# EAGLE board MCAT-CANYVAL-TOP-5X1 (EAGLE 7.2.0)
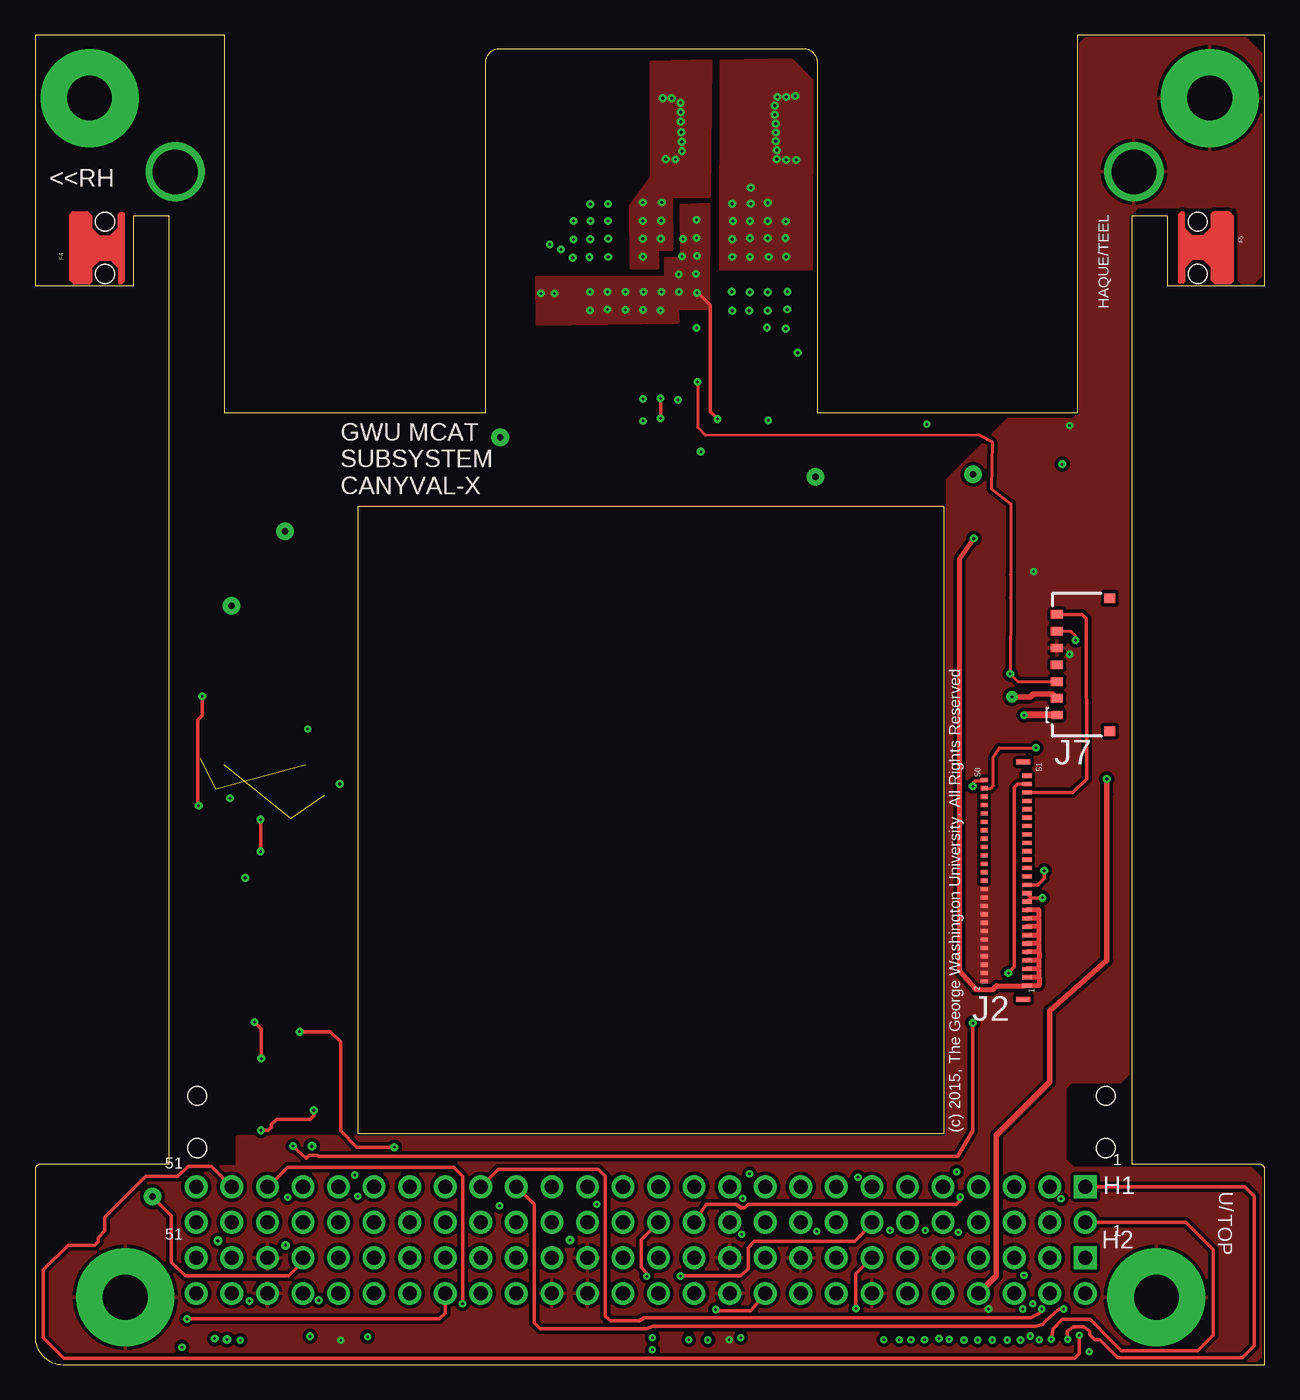
[diagram p4: board, top side]
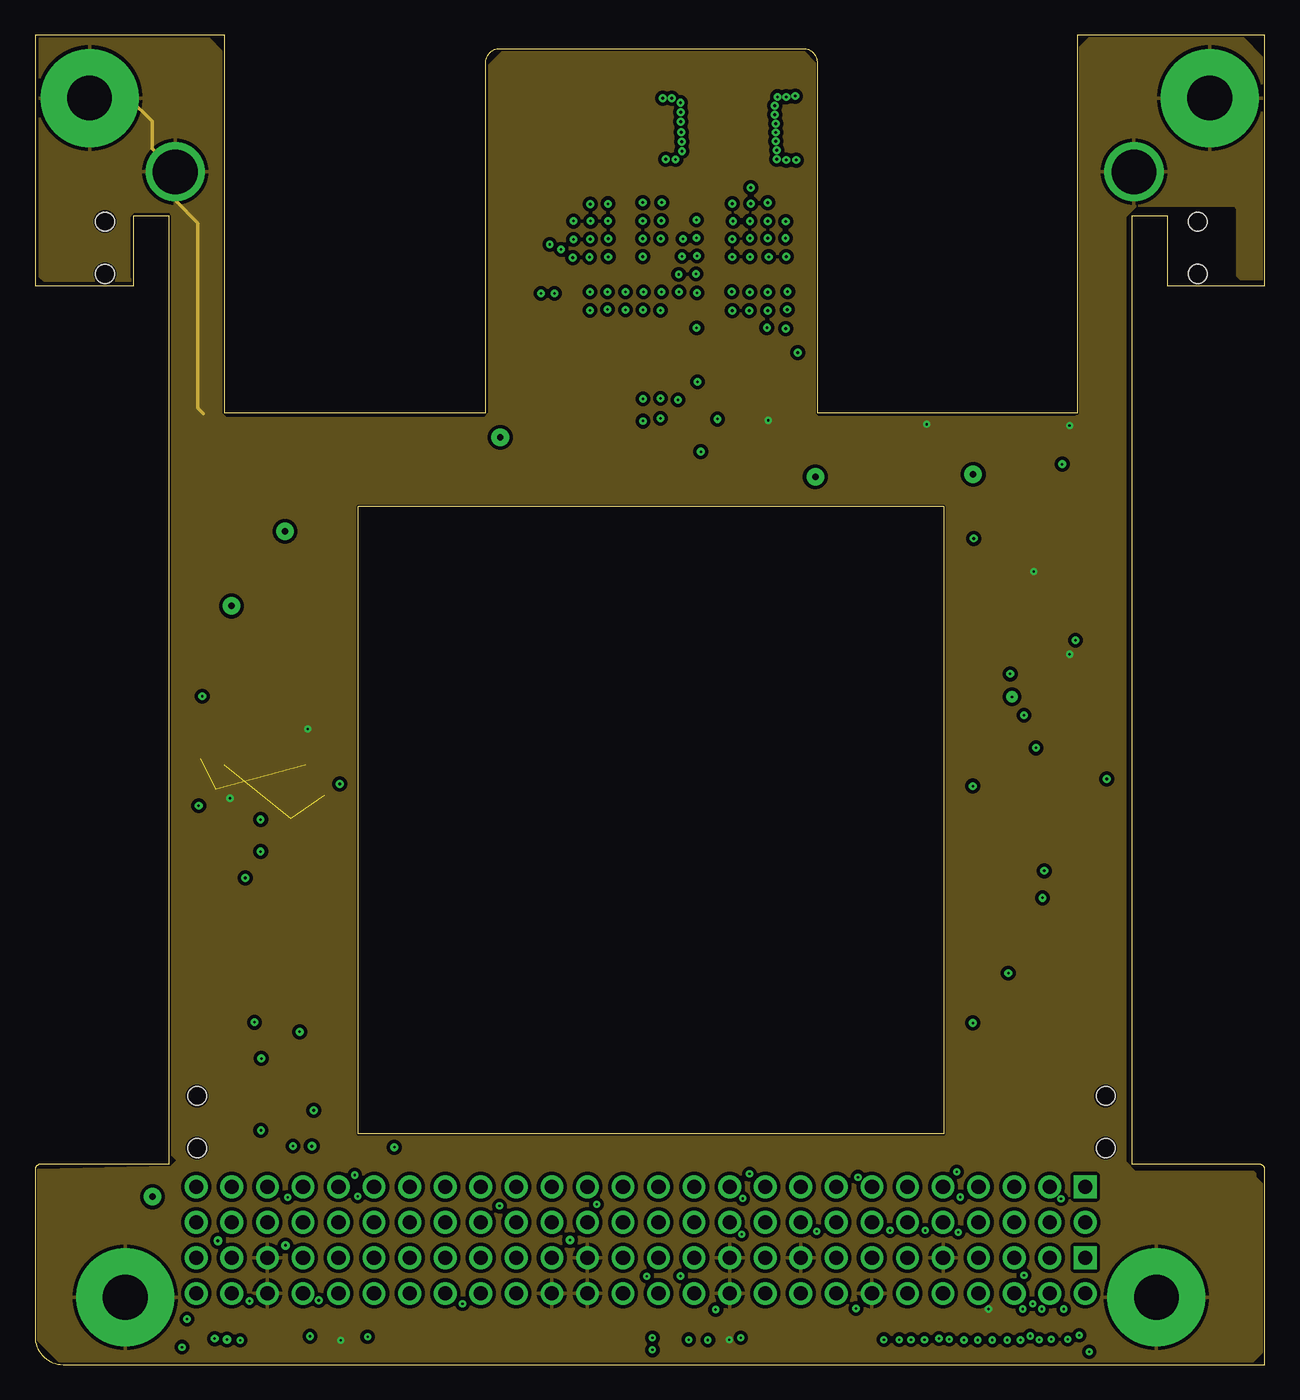
[diagram p5: board, inner layer L2/TopGround]
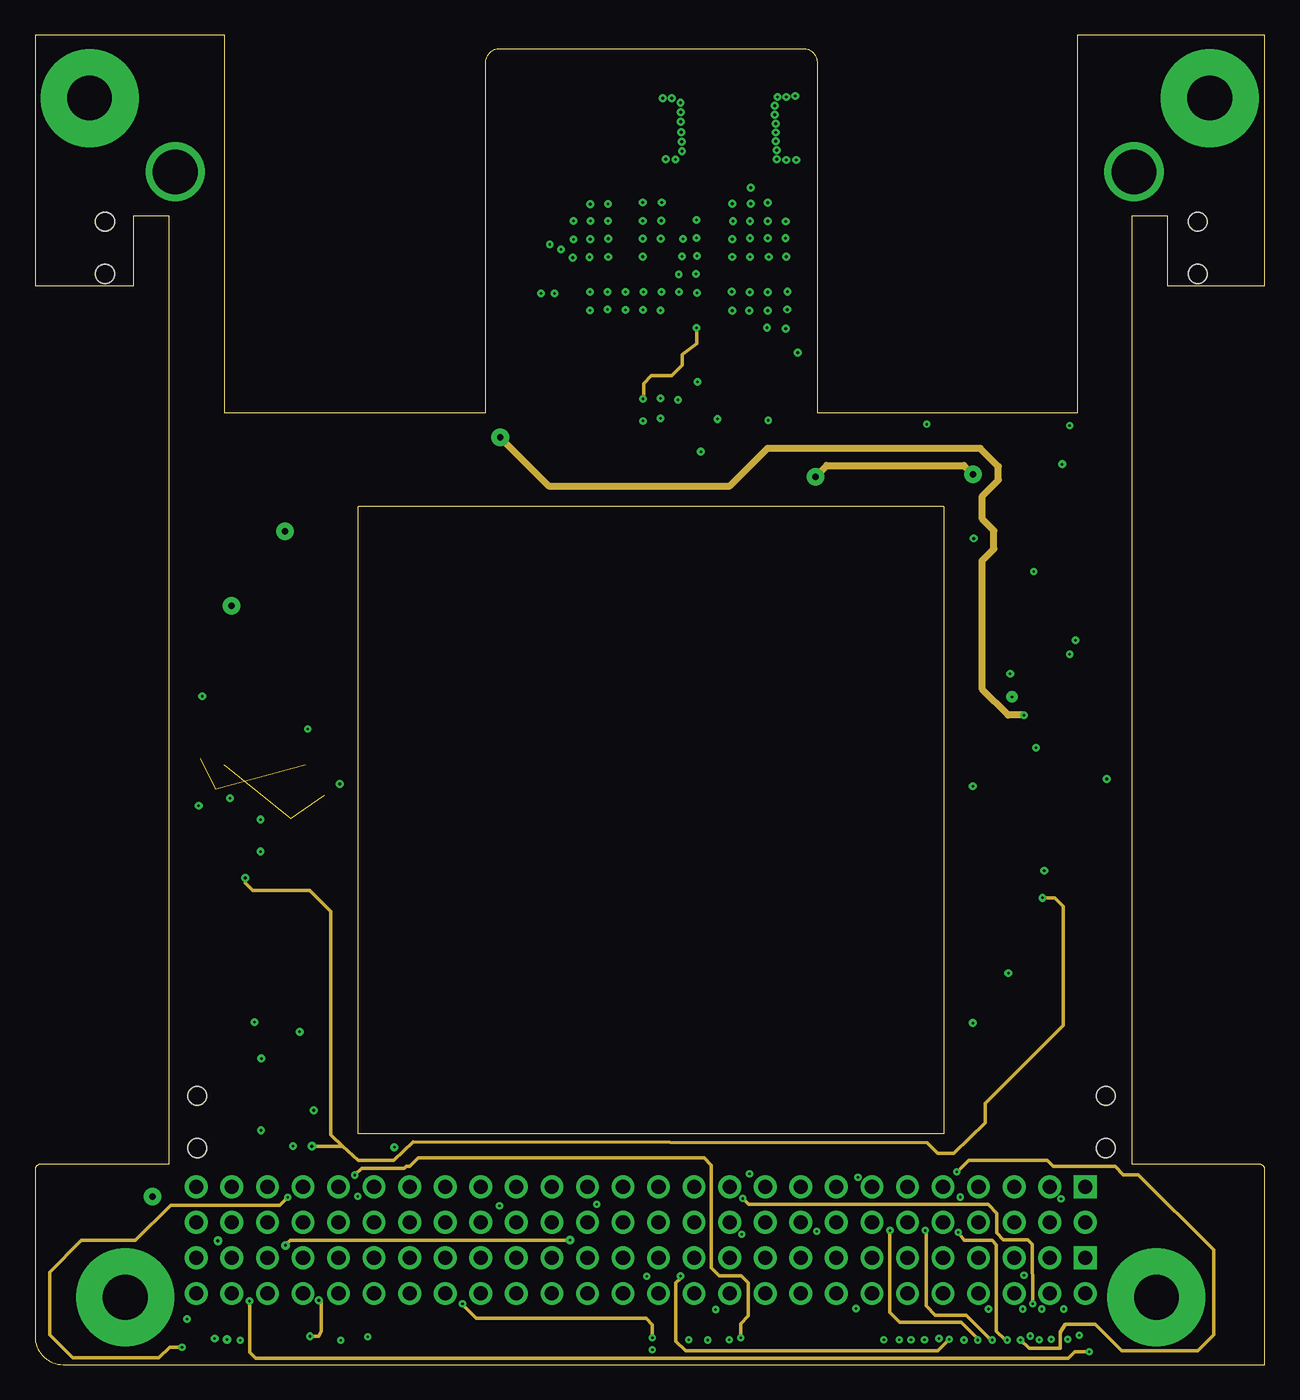
[diagram p6: board, inner layer L3/Power1]
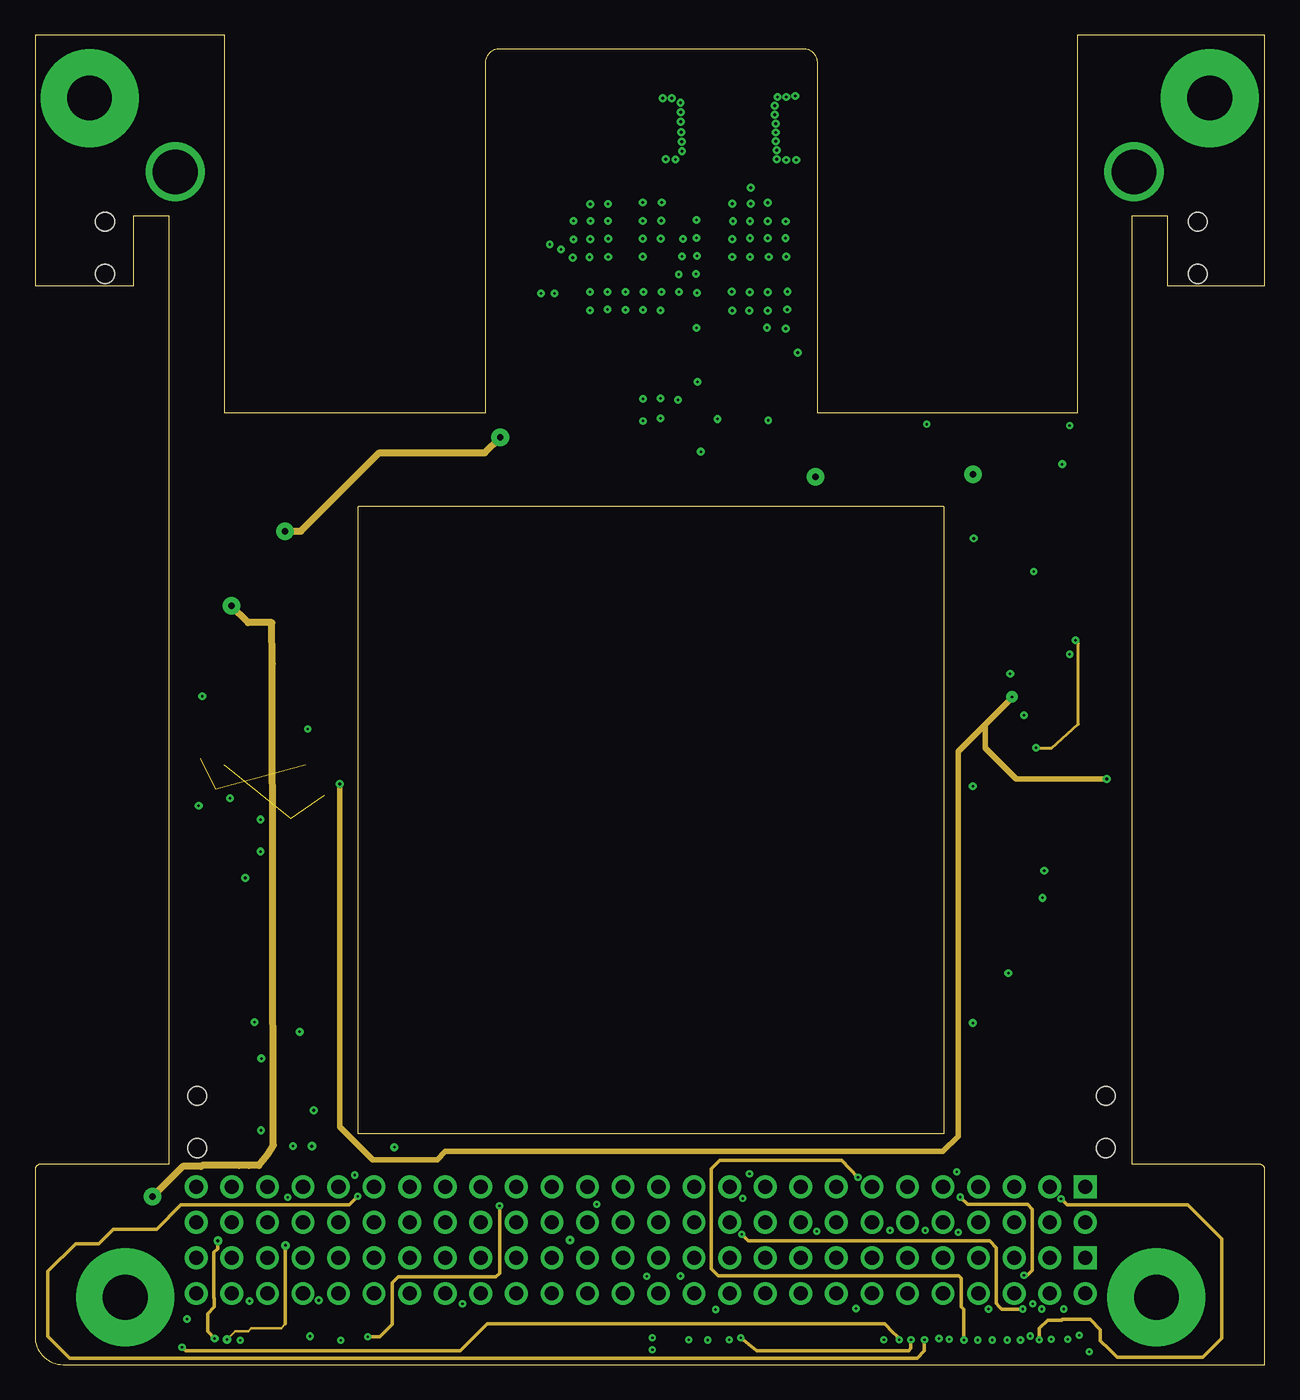
[diagram p7: board, inner layer L14/Power2]
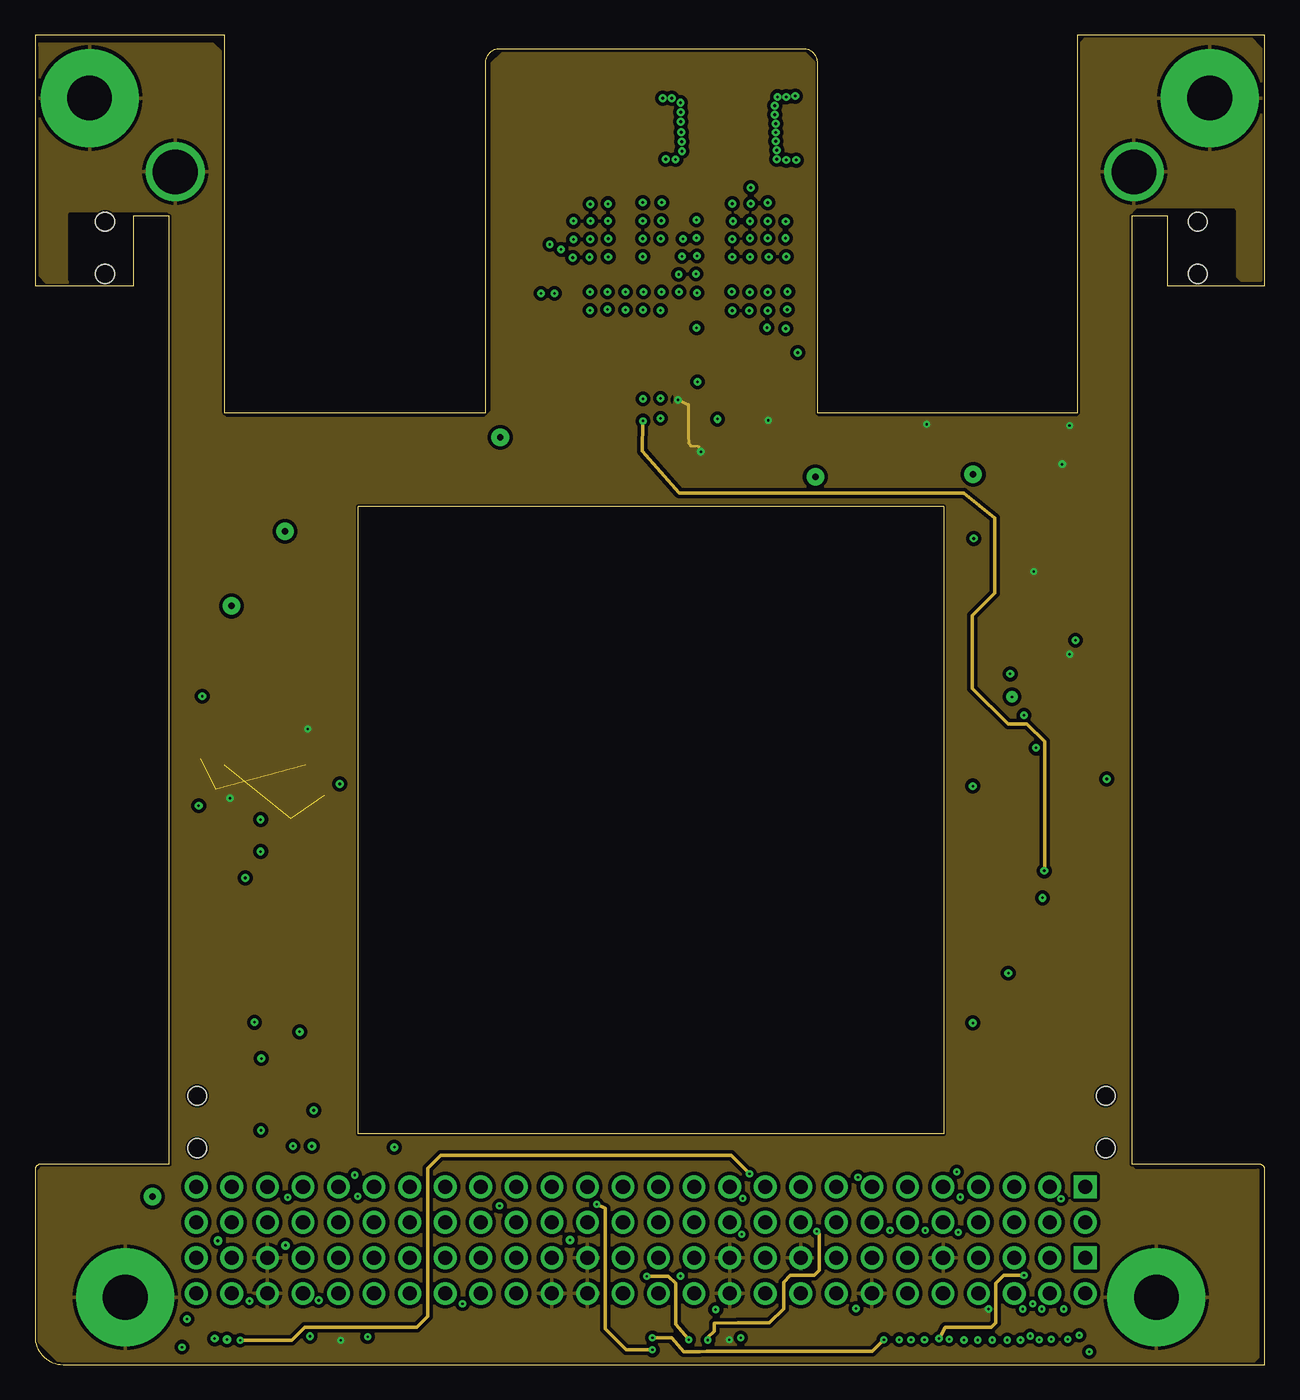
[diagram p8: board, inner layer L15/BottomGround]
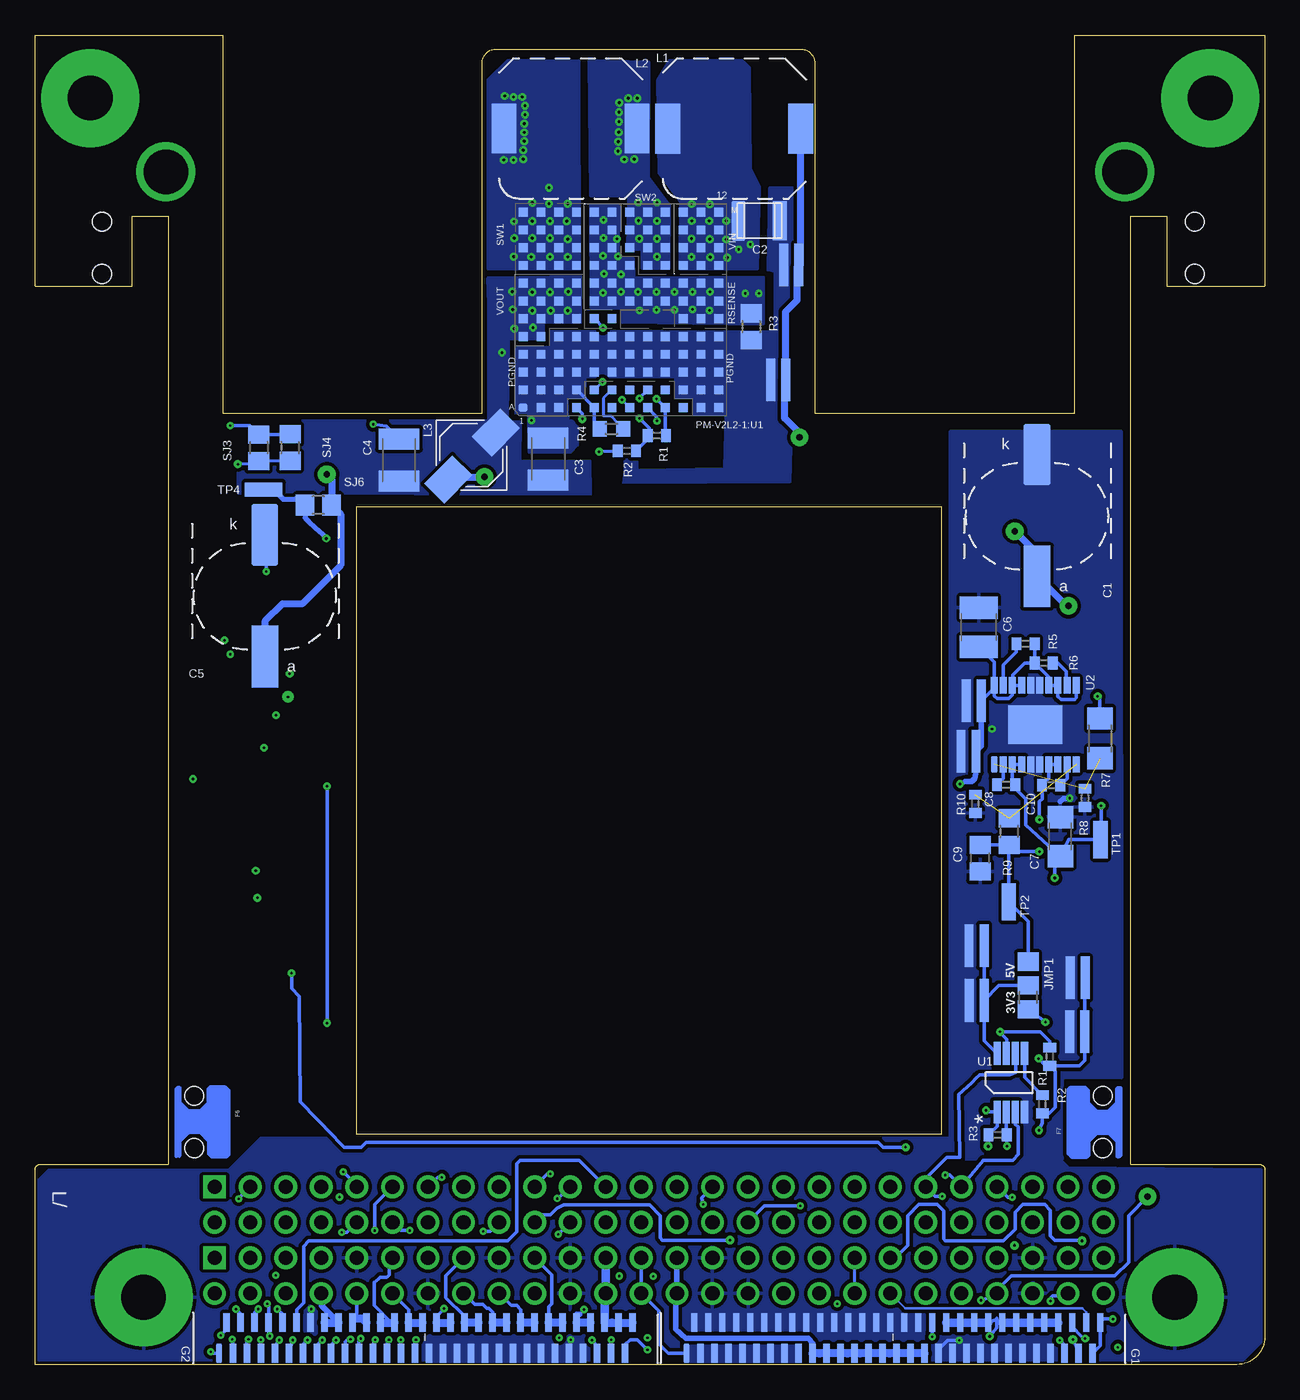
[diagram p9: board, bottom side, seen from below]

Size 87.85 x 95 mm. Coordinates in mm from the lower left corner, seen from the top.
Copper layers (1+2*3+14*15+16): L1/TopSignal 0.035559375mm / dielectric 3.5mil / L2/TopGround 0.01778125mm / dielectric 47mil / L3/Power1 0.0356mm / dielectric 12mil / L14/Power2 0.0356mm / dielectric 0.1499mm / L15/BottomGround 0.01778125mm / dielectric 3.5mil / L16/BottomSignal 0.035559375mm
Design rules "mcat-4cu-c-X3 *": minimum track width 6mil, minimum drill 6mil, track to track 10mil, track to pad 5mil, pad to pad 5mil, via to via 6mil, smd to smd 1mil, copper to edge 5mil, drill to drill 5mil, minimum pad ring 12mil, minimum via ring 7mil, stop-mask expansion 0mil, vias tented up to drill 8mil, thermal gap 10mil
Net classes: 0 default: width 0.051 mm; 1 1A-2OZ: width 0.152 mm; 2 2A-2OZ: width 0.356 mm; 3 0.3A-2OZ: width 0.254 mm; 4 General-1mil-100mA: width 0.025 mm; 5 0.5-2OZ: width 0.051 mm; 6 3A-2OZ: width 1.194 mm; 7 4.5A-2OZ: width 1.524 mm

## Footprints (pad centres in the part's own frame; a part is rotated, then mirrored left to right if it is on the bottom)
MCAT-4CU-C-TOP-V4-BLANK = drill 3.2: GND -78.97,85.22; GND@6 -10.49,85.22 | drill 3.2 pad 7: GND@1 -5.08,90.5; GND@2 -8.89,4.8; GND@3 -85.09,90.5; GND@4 -82.55,4.8
0612-REV = smd 3.05 x 0.635: 1 0,0; 2 0,1.077
MOLEX-78171-5007 = smd 0.6 x 0.85: 1 -3.6,0; 2 -2.4,0; 3 -1.2,0; 4 0,0; 5 1.2,0; 6 2.4,0; 7 3.6,0 | smd 0.7 x 0.8: 99 -4.75,-3.775; 100 4.75,-3.775
A0R-JMP = smd 1.5 x 1.3: 1 0,1.7; 2 0,0; 3 0,-1.7
R0402 = smd 0.7 x 0.9: 1 -0.65,0; 2 0.65,0
SOT505-1 = smd 1.626 x 0.508: 1 -2.095,0.975; 2 -2.095,0.325; 3 -2.095,-0.325; 4 -2.095,-0.975; 5 2.095,-0.975; 6 2.095,-0.325; 7 2.095,0.325; 8 2.095,0.975
SMTRA-M2-6-5 = hole 1.35: -1.869,0; 1.869,0
HIROSE-FH40-60S-0.5SV = smd 0.455 x 1.35: 1 0,0; 2 -1,0; 3 -2,0; 4 -3,0; 5 -4,0; 6 -5,0; 7 -6,0; 8 -7,0; 9 -8,0; 10 -9,0; 11 -10,0; 12 -11,0; 13 -12,0; 14 -13,0; 15 -14,0; 16 -15,0; 17 -16,0; 18 -17,0; 19 -18,0; 20 -19,0; 21 -20,0; 22 -21,0; 23 -22,0; 24 -23,0; 25 -24,0; 26 -25,0; 27 -26,0; 28 -27,0; 29 -28,0; 30 -29,0; 31 -0.554,-2.198; 32 -1.554,-2.198; 33 -2.554,-2.198; 34 -3.554,-2.198; 35 -4.554,-2.198; 36 -5.554,-2.198; 37 -6.554,-2.198; 38 -7.554,-2.198; 39 -8.554,-2.198; 40 -9.554,-2.198; 41 -10.554,-2.198; 42 -11.554,-2.198; 43 -12.554,-2.198; 44 -13.554,-2.198; 45 -14.554,-2.198; 46 -15.554,-2.198; 47 -16.554,-2.198; 48 -17.554,-2.198; 49 -18.554,-2.198; 50 -19.554,-2.198; 51 -20.554,-2.198; 52 -21.554,-2.198; 53 -22.554,-2.198; 54 -23.554,-2.198; 55 -24.554,-2.198; 56 -25.554,-2.198; 57 -26.554,-2.198; 58 -27.554,-2.198; 59 -28.554,-2.198; 60 -29.554,-2.198
CONN-2X26X0.1-HDR = drill 1.016 pad 1.524 square: 1 0,0 | drill 1.016 pad 1.524: 2 0,2.54; 3 2.54,0; 4 2.54,2.54; 5 5.08,0; 6 5.08,2.54; 7 7.62,0; 8 7.62,2.54; 9 10.16,0; 10 10.16,2.54; 11 12.7,0; 12 12.7,2.54; 13 15.24,0; 14 15.24,2.54; 15 17.78,0; 16 17.78,2.54; 17 20.32,0; 18 20.32,2.54; 19 22.86,0; 20 22.86,2.54; 21 25.4,0; 22 25.4,2.54; 23 27.94,0; 24 27.94,2.54; 25 30.48,0; 26 30.48,2.54; 27 33.02,0; 28 33.02,2.54; 29 35.56,0; 30 35.56,2.54; 31 38.1,0; 32 38.1,2.54; 33 40.64,0; 34 40.64,2.54; 35 43.18,0; 36 43.18,2.54; 37 45.72,0; 38 45.72,2.54; 39 48.26,0; 40 48.26,2.54; 41 50.8,0; 42 50.8,2.54; 43 53.34,0; 44 53.34,2.54; 45 55.88,0; 46 55.88,2.54; 47 58.42,0; 48 58.42,2.54; 49 60.96,0; 50 60.96,2.54; 51 63.5,0; 52 63.5,2.54
MOLEX-502598-5193 = smd 0.3 x 0.67: 1 -7.5,0.135; 3 -6.9,0.135; 5 -6.3,0.135; 7 -5.7,0.135; 9 -5.1,0.135; 11 -4.5,0.135; 13 -3.9,0.135; 15 -3.3,0.135; 17 -2.7,0.135; 19 -2.1,0.135; 21 -1.5,0.135; 23 -0.9,0.135; 25 -0.3,0.135; 27 0.3,0.135; 29 0.9,0.135; 31 1.5,0.135; 33 2.1,0.135; 35 2.7,0.135; 37 3.3,0.135; 39 3.9,0.135; 41 4.5,0.135; 43 5.1,0.135; 45 5.7,0.135; 47 6.3,0.135; 49 6.9,0.135; 51 7.5,0.135 | smd 0.3 x 0.5: 2 -7.2,3.2; 4 -6.6,3.2; 6 -6,3.2; 8 -5.4,3.2; 10 -4.8,3.2; 12 -4.2,3.2; 14 -3.6,3.2; 16 -3,3.2; 18 -2.4,3.2; 20 -1.8,3.2; 22 -1.2,3.2; 24 -0.6,3.2; 26 0,3.2; 28 0.6,3.2; 30 1.2,3.2; 32 1.8,3.2; 34 2.4,3.2; 36 3,3.2; 38 3.6,3.2; 40 4.2,3.2; 42 4.8,3.2; 44 5.4,3.2; 46 6,3.2; 48 6.6,3.2; 50 7.2,3.2 | smd 0.35 x 1: 99 -8.475,0.4; 100 8.475,0.4
OS-CON-SVPF-F12 = smd 1.9 x 4.4: A1 0,-4.3; K1 0,4.4
MLCC-X7R-1210 = smd 1 x 2.8: 1 1.6,0.05; 2 -1.35,0.05
C1210K = smd 1.5 x 2.9: 1 -1.5,0; 2 1.5,0
C1210 = smd 1.6 x 2.7: 1 -1.4,0; 2 1.4,0
C1206 = smd 1.6 x 1.8: 1 -1.4,0; 2 1.4,0
C0402 = smd 0.7 x 0.9: 1 -0.65,0; 2 0.65,0
C0805 = smd 1.3 x 1.5: 1 -0.95,0; 2 0.95,0
MSS1048 = smd 3.56 x 1.78: 1 5,9.85; 2 5,0.35
SERIES-POWER-INDUCTORS = smd 2.85 x 2 rotated 45: 1 1.75,1.6; 2 -1.65,-1.75
R0805 = smd 1.3 x 1.5: 1 -0.95,0; 2 0.95,0
R0603 = smd 1 x 1.1: 1 -0.85,0; 2 0.85,0
R1206 = smd 1.6 x 1.803: 1 -1.422,0; 2 1.422,0
PCB-MINI-SMD-TESTPOINT = smd 2.667 x 1.016: 1 0,0
LGA-141-LTC-05-08-1840-B = smd 0.63 x 0.63: A1 0.567,0.565; A2 1.837,0.565; A3 3.107,0.565; A4 4.377,0.565; A5 5.647,0.565; A6 6.917,0.565; A7 8.187,0.565; A8 9.457,0.565; A9 10.727,0.565; A10 11.997,0.565; A11 13.267,0.565; A12 14.537,0.565; B1 0.567,1.835; B2 1.837,1.835; B3 3.107,1.835; B4 4.377,1.835; B5 5.647,1.835; B6 6.917,1.835; B7 8.187,1.835; B8 9.457,1.835; B9 10.727,1.835; B10 11.997,1.835; B11 13.267,1.835; B12 14.537,1.835; C1 0.567,3.105; C2 1.837,3.105; C3 3.107,3.105; C4 4.377,3.105; C5 5.647,3.105; C6 6.917,3.105; C7 8.187,3.105; C8 9.457,3.105; C9 10.727,3.105; C10 11.997,3.105; C11 13.267,3.105; C12 14.537,3.105; D1 0.567,4.375; D2 1.837,4.375; D3 3.107,4.375; D4 4.377,4.375; D5 5.647,4.375; D6 6.917,4.375; D7 8.187,4.375; D8 9.457,4.375; D9 10.727,4.375; D10 11.997,4.375; D11 13.267,4.375; D12 14.537,4.375; E1 0.567,5.645; E2 1.837,5.645; E3 3.107,5.645; E4 4.377,5.645; E5 5.647,5.645; E6 6.917,5.645; E7 8.187,5.645; E8 9.457,5.645; E9 10.727,5.645; E10 11.997,5.645; E11 13.267,5.645; E12 14.537,5.645; F1 0.567,6.915; F2 1.837,6.915; F3 3.107,6.915; F4 4.377,6.915; F5 5.647,6.915; F6 6.917,6.915; F10 11.997,6.915; F11 13.267,6.915; F12 14.537,6.915; G1 0.567,8.185; G2 1.837,8.185; G3 3.107,8.185; G4 4.377,8.185; G5 5.647,8.185; G6 6.917,8.185; G7 8.187,8.185; G8 9.457,8.185; G9 10.727,8.185; G10 11.997,8.185; G11 13.267,8.185; G12 14.537,8.185; H2 1.837,9.455; H3 3.107,9.455; H4 4.377,9.455; H5 5.647,9.455; H6 6.917,9.455; H7 8.187,9.455; H8 9.457,9.455; H9 10.727,9.455; H10 11.997,9.455; H11 13.267,9.455; H12 14.537,9.455; J5 5.647,10.725; J6 6.917,10.725; J7 8.187,10.725; J8 9.457,10.725; J9 10.727,10.725; J10 11.997,10.725; J11 13.267,10.725; J12 14.537,10.725; K5 5.647,11.995; K6 6.917,11.995; K7 8.187,11.995; K8 9.457,11.995; K9 10.727,11.995; K10 11.997,11.995; K11 13.267,11.995; K12 14.537,11.995; L5 5.647,13.265; L6 6.917,13.265; L7 8.187,13.265; L8 9.457,13.265; L9 10.727,13.265; L10 11.997,13.265; L11 13.267,13.265; L12 14.537,13.265; M5 5.647,14.535; M6 6.917,14.535; M7 8.187,14.535; M8 9.457,14.535; M9 10.727,14.535; M10 11.997,14.535; M11 13.267,14.535; M12 14.537,14.535; SW1@J1 0.567,10.725; SW1@J2 1.837,10.725; SW1@J3 3.107,10.725; SW1@J4 4.377,10.725; SW1@K1 0.567,11.995; SW1@K2 1.837,11.995; SW1@K3 3.107,11.995; SW1@K4 4.377,11.995; SW1@L1 0.567,13.265; SW1@L2 1.837,13.265; SW1@L3 3.107,13.265; SW1@L4 4.377,13.265; SW1@M1 0.567,14.535; SW1@M2 1.837,14.535; SW1@M3 3.107,14.535; SW1@M4 4.377,14.535; VOUT 0.567,9.455
TSSOP20-FE-CB = smd 0.5 x 1.15: 1 0,0; 2 0.65,0; 3 1.3,0; 4 1.95,0; 5 2.6,0; 6 3.25,0; 7 3.9,0; 8 4.55,0; 9 5.2,0; 10 5.85,0; 11 5.85,5.65; 12 5.2,5.65; 13 4.55,5.65; 14 3.9,5.65; 15 3.25,5.65; 16 2.6,5.65; 17 1.95,5.65; 18 1.3,5.65; 19 0.65,5.65; 20 0,5.65 | smd 3.862 x 2.74: 21 2.925,2.825

## Placement (x,y rotation side)
B8  MCAT-4CU-C-PCB/TOP  [MCAT-4CU-C-TOP-V4-BLANK]  88.99,0 0 top
CT-V2L1-1:BC3  BYPASS-CAP-1UF  [0612-REV]  12.85,23.79 90 bottom
CT-V2L1-1:BC4  BYPASS-CAP-0.1UF  [0612-REV]  12.84,27.64 90 bottom
CT-V2L1-1:BC5  BYPASS-CAP-1UF  [0612-REV]  20.06,29.93 90 bottom
CT-V2L1-1:BC6  BYPASS-CAP-0.1UF  [0612-REV]  20.05,26.02 90 bottom
CT-V2L1-1:J7  MOLEX-78171-5007  [MOLEX-78171-5007]  72.99,50 90 top
CT-V2L1-1:JMP1  0R-JUMPA  [A0R-JMP]  16.91,27.08 180 bottom
CT-V2L1-1:R1  10k  [R0402]  15.36,22 270 bottom
CT-V2L1-1:R2  10k  [R0402]  15.9,18.6 270 bottom
CT-V2L1-1:R3  10k  [R0402]  19.09,16.41 180 bottom
CT-V2L1-1:U1  PCA9512ADP  [SOT505-1]  18.14,20.13 90 bottom
F4  SMTRAM2-6-5  [SMTRA-M2-6-5]  5.01,79.79 90 top
F5  SMTRAM2-6-5  [SMTRA-M2-6-5]  83.06,79.79 270 top
F6  SMTRAM2-6-5  [SMTRA-M2-6-5]  76.48,17.32 270 bottom
F7  SMTRAM2-6-5  [SMTRA-M2-6-5]  11.58,17.32 90 bottom
GBUS-TOP1:G1  HIROSE-FH40-60S-0.5SV  [HIROSE-FH40-60S-0.5SV]  41.31,0.8 180 bottom
GBUS-TOP1:G2  HIROSE-FH40-60S-0.5SV  [HIROSE-FH40-60S-0.5SV]  74.71,0.8 180 bottom
GBUS-TOP1:H1  H1-H5-INBOARD-CSK-BUS-CONN  [CONN-2X26X0.1-HDR]  75.02,12.7 180 top
GBUS-TOP1:H2  H2-H6-OUTBOARD-CSK-BUS-CONN  [CONN-2X26X0.1-HDR]  75.02,7.62 180 top
J2  MOLEX-502598-5193  [MOLEX-502598-5193]  70.99,34.57 90 top
PM-V2L2-1:BC1  BYPASS-CAP-0.1UF  [0612-REV]  20.63,43.82 90 bottom
PM-V2L2-1:BC2  BYPASS-CAP-1UF  [0612-REV]  20.25,47.43 90 bottom
PM-V2L2-1:BC3  BYPASS-CAP-0.1UF  [0612-REV]  33.3,78.58 90 bottom
PM-V2L2-1:BC4  BYPASS-CAP-1UF  [0612-REV]  34.23,70.35 90 bottom
PM-V2L2-1:C1  68uF  [OS-CON-SVPF-F12]  16.28,60.61 0 bottom
PM-V2L2-1:C2  4.7uF  [MLCC-X7R-1210]  36,81.77 180 bottom
PM-V2L2-1:C3  10uF  [C1210K]  51.2,64.71 90 bottom
PM-V2L2-1:C4  10uF  [C1210K]  61.85,64.63 90 bottom
PM-V2L2-1:C5  68uF  [OS-CON-SVPF-F12]  71.43,54.89 0 bottom
PM-V2L2-1:C6  10u  [C1210]  20.44,52.68 90 bottom
PM-V2L2-1:C7  10u  [C1206]  14.61,37.72 90 bottom
PM-V2L2-1:C8  10n  [C0402]  18.48,41.43 180 bottom
PM-V2L2-1:C9  3.3u  [C0805]  20.34,36.18 270 bottom
PM-V2L2-1:C10  10n  [C0402]  15.27,41.4 0 bottom
PM-V2L2-1:L1  33uH  [MSS1048]  43.01,93.31 270 bottom
PM-V2L2-1:L2  68uH  [MSS1048]  54.7,93.32 270 bottom
PM-V2L2-1:L3  10uH  [SERIES-POWER-INDUCTORS]  56.68,64.99 0 bottom
PM-V2L2-1:R1  2K  [R0402]  43.43,66.38 180 bottom
PM-V2L2-1:R2  1K  [R0402]  45.57,65.28 180 bottom
PM-V2L2-1:R3  27mOhms  [R0805]  36.69,74.15 270 bottom
PM-V2L2-1:R4  4k70.1%  [R0603]  46.67,66.85 0 bottom
PM-V2L2-1:R5  1M  [R0402]  17.1,51.5 0 bottom
PM-V2L2-1:R6  1M  [R0402]  15.79,50.13 180 bottom
PM-V2L2-1:R7  357K  [R1206]  11.79,44.74 90 bottom
PM-V2L2-1:R8  210K  [R0402]  12.86,40.49 90 bottom
PM-V2L2-1:R9  619K  [R0805]  18.28,38.09 270 bottom
PM-V2L2-1:R10  200K  [R0402]  20.69,40.06 90 bottom
PM-V2L2-1:SJ3  0R  [R0805]  71.87,65.51 270 bottom
PM-V2L2-1:SJ4  0R  [R0805]  69.63,65.53 270 bottom
PM-V2L2-1:SJ6  0R  [R0805]  67.61,61.4 180 bottom
PM-V2L2-1:TP1  PCB-MINI-SMD-TESTPOINT/SQ  [PCB-MINI-SMD-TESTPOINT]  11.75,37.5 270 bottom
PM-V2L2-1:TP2  PCB-MINI-SMD-TESTPOINT/SQ  [PCB-MINI-SMD-TESTPOINT]  18.29,33.05 90 bottom
PM-V2L2-1:TP4  PCB-MINI-SMD-TESTPOINT/SQ  [PCB-MINI-SMD-TESTPOINT]  71.52,62.52 180 bottom
PM-V2L2-1:U1  LTM4609MPV#PBF  [LGA-141-LTC-05-08-1840-B]  53.55,67.81 0 bottom
PM-V2L2-1:U2  LT3030MPFE#PBF  [TSSOP20-FE-CB]  19.33,42.88 0 bottom

## Tracks (layer width: path | path; a pad name or v marks a point on that pad's centre or on a via)
CT-V2L1-1:I2C_VCC
  L16/BottomSignal 0.254: CT-V2L1-1:U1.8 19.14,22.23 20.05,23.14 20.05,25.15 20,25.2 20,25.97 CT-V2L1-1:BC6.1 | CT-V2L1-1:BC6.1 CT-V2L1-1:BC5.1 | CT-V2L1-1:JMP1.2 19,27.08 CT-V2L1-1:BC6.1
CT-V2L1-1:N$2
  L16/BottomSignal 0.254: CT-V2L1-1:R2.1 17.17,20.52 CT-V2L1-1:U1.5
GBUS-TOP1:G-H1-1  (via drill 0.15 pad 0.51)
  L1/TopSignal 0.254: v73.77,1.8 73.72,2.36 74.15,2.69 74.91,2.69 75.34,2.36 75.34,2.11 75.7,1.75 76.06,1.75 77.33,0.48 86.24,0.48 87.11,1.35 87.11,12.01 86.42,12.7 GBUS-TOP1:H1.1
  L16/BottomSignal 0.254: GBUS-TOP1:G2.2 73.71,1.72 v73.77,1.8
GBUS-TOP1:G-H1-2  (via drill 0.15 pad 0.51)
  L1/TopSignal 0.254: v72.6,1.8 72.73,2.56 73.39,3.23 75.37,3.23 76.92,1.68 77.61,0.99 83.07,0.99 83.12,1.04 84.16,2.08 84.16,8.2 82.2,10.16 GBUS-TOP1:H1.2
  L16/BottomSignal 0.254: GBUS-TOP1:G2.3 72.71,1.76 v72.6,1.8
GBUS-TOP1:G-H1-3  (via drill 0.15, 0.15 pad 0.51)
  L14/Power2 0.254: v71.74,1.78 71.74,2.59 72.32,3.17 73.34,3.17 73.39,3.23 75.37,3.23 76.11,2.49 76.11,1.7 76.72,1.09 77.3,0.51 83.4,0.51 84.77,1.88 84.77,8.97 82.33,11.4 73.72,11.4 v73.29,11.84
  L16/BottomSignal 0.254: GBUS-TOP1:G2.4 71.74,0.82 v71.74,1.78 | v73.29,11.84 73.29,11.89 GBUS-TOP1:H1.3
GBUS-TOP1:G-H1-9  (via drill 0.15, 0.15 pad 0.51)
  L3/Power1 0.254: v70.39,1.75 71,1.14 72.09,1.14 73.24,1.17 73.24,2.31 73.59,2.87 75.73,2.87 77.63,0.96 83.04,0.96 84.18,2.11 84.18,2.29 84.18,8.18 78.8,13.56 77.73,13.56 77.15,14.15 72.73,14.15 72.3,14.58 66.68,14.58 65.87,13.77 v65.84,13.77
  L16/BottomSignal 0.254: GBUS-TOP1:G2.5 70.71,1.3 v70.39,1.75 | v65.84,13.77 64.86,12.78 GBUS-TOP1:H1.9
GBUS-TOP1:G-H1-10  (via drill 0.15, 0.15 pad 0.51)
  L3/Power1 0.254: v69.45,1.75 69.3,1.75 68.67,2.39 68.67,8.56 68.36,8.87 66.38,8.87 v65.95,9.45
  L16/BottomSignal 0.254: GBUS-TOP1:G2.6 v69.45,1.75 | v65.95,9.45 65.57,9.45 GBUS-TOP1:H1.10
GBUS-TOP1:G-H1-11  (via drill 0.15, 0.15 pad 0.51)
  L3/Power1 0.254: v68.39,1.75 68.28,1.75 66.51,3.53 64.32,3.53 63.66,4.19 63.66,9.5 v63.58,9.58
  L16/BottomSignal 0.254: GBUS-TOP1:G2.7 68.71,1.42 v68.39,1.75 | v63.58,9.58 63.58,11.44 GBUS-TOP1:H1.11
GBUS-TOP1:G-H1-12  (via drill 0.15, 0.15 pad 0.51)
  L3/Power1 0.254: v67.34,1.75 67.34,1.85 66.17,3.02 61.78,3.02 61.07,3.73 v61.07,9.58
  L16/BottomSignal 0.254: GBUS-TOP1:G2.8 67.71,1.38 v67.34,1.75 | v61.07,9.58 61.74,9.58 GBUS-TOP1:H1.12
GBUS-TOP1:G-H1-13  (via drill 0.15, 0.15 pad 0.51)
  L14/Power2 0.254: v66.35,1.75 66.35,3.94 66.15,4.14 66.15,6.17 65.97,6.35 48.8,6.35 48.32,6.83 48.32,13.99 48.9,14.58 57.64,14.58 v58.78,13.39
  L16/BottomSignal 0.254: GBUS-TOP1:G2.9 66.71,1.39 v66.35,1.75 | v58.78,13.39 59.09,13.39 GBUS-TOP1:H1.13
GBUS-TOP1:G-H1-14  (via drill 0.15, 0.15 pad 0.51)
  L1/TopSignal 0.254: GBUS-TOP1:H1.14 59.78,10.04 58.55,8.81 51.39,8.81 50.93,8.36 50.93,6.83 50.43,6.33 v46.11,6.33
  L3/Power1 0.254: v46.11,6.33 46.11,6.17 45.78,5.84 45.78,1.68 46.46,0.99 64.5,0.99 v65.31,1.8
  L16/BottomSignal 0.254: v65.31,1.8 65.52,1.8 65.69,1.63 65.69,0.82 GBUS-TOP1:G2.10
GBUS-TOP1:G-H1-18  (via drill 0.15)
  L15/BottomGround 0.254: v48.06,1.75 48.06,1.93 48.52,2.39 48.52,2.95 50.2,2.97 52.46,2.97 53.47,3.99 53.47,5.89 53.96,6.38 55.66,6.38 56.02,6.73 56.02,9.35 v55.84,9.53
  L16/BottomSignal 0.254: GBUS-TOP1:G2.28 47.71,1.35 v48.06,1.75 | v55.84,9.53 55.33,9.53 GBUS-TOP1:H1.18
GBUS-TOP1:G-H1-19  (via drill 0.15)
  L15/BottomGround 0.254: v14.66,1.73 18.32,1.73 19.26,2.67 27.26,2.67 28.05,3.45 28.05,14.02 28.96,14.94 49.72,14.94 v51.04,13.61
  L16/BottomSignal 0.254: GBUS-TOP1:G1.28 14.31,1.38 v14.66,1.73 | v51.04,13.61 51.25,13.61 GBUS-TOP1:H1.19
GBUS-TOP1:G-H1-20  (via drill 0.18 pad 0.61, 0.2 pad 0.61)
  L3/Power1 0.254: v17.89,8.51 18.25,8.87 18.58,8.87 18.6,8.89 v38.21,8.89
  L14/Power2 0.178: v13.72,1.79 14.3,2.36 15.22,2.36 15.45,2.59 17.58,2.59 17.89,2.9
  L14/Power2 0.254: 17.89,2.9 v17.89,8.51
  L16/BottomSignal 0.178: GBUS-TOP1:G1.29 v13.72,1.79
  L16/BottomSignal 0.254: v38.21,8.89 43.04,8.89 43.19,9.04 43.19,10.64 43.95,11.4 50,11.4 50.1,11.4 50.58,11.15 51.04,10.69 51.63,10.69 GBUS-TOP1:H1.20
GBUS-TOP1:G-H1-21  (via drill 0.15, 0.15 pad 0.46)
  L3/Power1 0.254: v50.55,11.86 50.99,11.43 52.92,11.43 68.08,11.43 68.69,10.82 68.69,9.4 69.17,8.91 70.9,8.91 71.23,8.59 v71.25,4.34
  L16/BottomSignal 0.254: GBUS-TOP1:G2.34 71.16,2.32 | GBUS-TOP1:G2.34 71.16,2.17 v71.08,2.03 | v50.55,11.86 50.46,11.86 GBUS-TOP1:H1.21 | v71.25,4.34 71.16,4.25 GBUS-TOP1:G2.34
GBUS-TOP1:G-H1-22  (via drill 0.15)
  L14/Power2 0.254: v70.54,3.96 69.98,3.96 69.07,3.96 68.87,4.14 68.67,4.37 68.67,8.36 68.18,8.84 68,8.84 67.09,8.84 50.93,8.84 v50.48,9.3
  L16/BottomSignal 0.254: GBUS-TOP1:G2.35 70.16,3.58 v70.54,3.96 | v50.48,9.3 GBUS-TOP1:H1.22
GBUS-TOP1:G-H1-23
  L16/BottomSignal 0.254: GBUS-TOP1:G2.36 69.16,3.92 68.67,4.42 68.67,8.46 68.28,8.84 54.08,8.84 53.45,9.47 53.45,14.33 53.2,14.58 48.96,14.58 GBUS-TOP1:H1.23
GBUS-TOP1:G-H1-24  (via drill 0.15, 0.15 pad 0.51)
  L1/TopSignal 0.254: GBUS-TOP1:H1.24 47.96,11.43 50.05,11.43 50.45,11.2 50.71,11.2 50.93,11.43 51.06,11.43 51.85,11.43 65.79,11.43 66.1,11.73 v66.1,11.96
  L14/Power2 0.254: v66.1,11.96 66.63,11.43 66.78,11.43 70.9,11.43 71.23,11.1 71.23,6.73 70.87,6.38 v70.65,6.38
  L15/BottomGround 0.254: v70.65,6.38 69.2,6.38 68.64,5.82 68.64,4.22 68.64,3 68.31,2.67 67.09,2.67 65.01,2.67 64.71,2.07 64.68,2.03 v64.58,1.85
  L16/BottomSignal 0.254: 64.71,0.84 GBUS-TOP1:G2.11 64.71,1.67 v64.58,1.85
GBUS-TOP1:G-H1-26  (via drill 0.15)
  L1/TopSignal 0.254: v43.7,6.3 43.7,6.53 43.29,6.93 43.29,8.91 GBUS-TOP1:H1.26
  L15/BottomGround 0.254: v46.69,1.78 46.62,1.88 45.75,2.87 45.75,5.79 45.25,6.3 v43.7,6.3
  L16/BottomSignal 0.254: GBUS-TOP1:G2.29 46.71,1.47 v46.69,1.78
GBUS-TOP1:G-H1-29  (via drill 0.15)
  L15/BottomGround 0.254: v44.1,1.04 42.22,1.04 40.72,2.54 40.72,11.15 v40.11,11.46
  L16/BottomSignal 0.254: GBUS-TOP1:G2.30 45.71,1.41 45.35,1.78 44.84,1.78 v44.1,1.04 | v40.11,11.46 40.24,11.92 GBUS-TOP1:H1.29
GBUS-TOP1:G-H1-33  (via drill 0.15)
  L1/TopSignal 0.254: v73.49,3.96 73.14,3.96 72.17,3.07 71.97,2.87 71.48,2.74 44.13,2.72 43.65,2.54 36.08,2.54 35.64,2.97 35.64,11.44 GBUS-TOP1:H1.33
  L16/BottomSignal 0.254: GBUS-TOP1:G2.32 73.16,3.63 v73.49,3.96
GBUS-TOP1:G-H1-35  (via drill 0.15)
  L1/TopSignal 0.254: v71.92,3.96 71.92,3.79 71.18,3.38 71.13,3.33 70.8,3.33 49.21,3.33 43.52,3.33 43.16,3.12 41.13,3.12 40.72,3.43 40.72,13.44 40.22,13.95 33.08,13.95 GBUS-TOP1:H1.35
  L16/BottomSignal 0.254: GBUS-TOP1:G2.33 72.16,3.72 v71.92,3.96
GBUS-TOP1:G-H1-45  (via drill 0.15, 0.15 pad 0.51)
  L3/Power1 0.254: v10.5,1.25 9.61,1.25 8.85,0.48 2.7,0.48 1.05,2.13 1.05,6.6 3.31,8.87 7.17,8.87 9.69,11.38 17.48,11.38 v18.04,11.94
  L14/Power2 0.254: v10.5,1.25 10.75,0.99 30.39,0.99 32.29,2.9 60.69,2.9 61.27,2.31 61.58,2.01 61.58,1.93 v61.73,1.78
  L16/BottomSignal 0.254: GBUS-TOP1:G2.14 61.71,1.35 | 61.71,1.35 61.71,1.51 | v18.04,11.94 18.38,11.94 GBUS-TOP1:H1.45 | v61.73,1.78 61.73,1.36 61.71,1.35
GBUS-TOP1:G-H1-47  (via drill 0.15, 0.15 pad 0.51)
  L1/TopSignal 0.254: GBUS-TOP1:H1.47 16.67,12.7 18.07,14.1 29.9,14.1 30.54,13.46 v30.54,4.34
  L3/Power1 0.254: v30.54,4.34 30.54,4.27 31.5,3.3 43.65,3.3 44.1,2.85 v44.1,1.91
  L15/BottomGround 0.254: v44.1,1.91 45.47,1.91 46.34,0.91 47.48,0.91 47.99,0.94 59.8,0.94 v60.64,1.78
  L16/BottomSignal 0.254: GBUS-TOP1:G2.15 60.71,1.65 v60.64,1.78
GBUS-TOP1:G-H1-49  (via drill 0.15 pad 0.51)
  L1/TopSignal 0.254: v74.58,2.08 74.58,0.76 74.28,0.46 2.04,0.46 0.59,1.91 0.59,6.76 2.37,8.53 4.28,8.53 4.5,8.76 4.5,9.07 4.99,9.55 4.99,10.52 7.91,13.44 10.19,13.44 10.93,14.17 12.59,14.17 GBUS-TOP1:H1.49
  L16/BottomSignal 0.254: GBUS-TOP1:G2.31 74.16,2.53 v74.58,2.08
GBUS-TOP1:G-H2-50  (via drill 0.15 pad 0.51, 0.18)
  L3/Power1 0.254: v75.29,0.91 74.28,0.91 73.85,0.48 73.82,0.46 15.76,0.46 15.32,0.89 v15.32,4.55
  L16/BottomSignal 0.254: GBUS-TOP1:G2.1 75.13,0.8 v75.29,0.91 | v15.32,4.55 15.32,4.72 15.15,4.9 14.24,4.9 GBUS-TOP1:H2.50
GBUS-TOP1:M-3V3-BUS
  L16/BottomSignal 0.203: GBUS-TOP1:G1.10 32.31,1.52 | 42.07,5.01 GBUS-TOP1:H2.28
  L16/BottomSignal 0.254: GBUS-TOP1:G1.12 29.8,0.8 | GBUS-TOP1:G1.13 28.91,0.8 | GBUS-TOP1:G1.14 GBUS-TOP1:G1.15 | GBUS-TOP1:G1.18 24.38,0.8 24.42,0.84 25.27,0.84 GBUS-TOP1:G1.17 | GBUS-TOP1:G1.16 26.8,0.8 | GBUS-TOP1:G1.11 31.81,0.8
  L16/BottomSignal 0.406: GBUS-TOP1:H2.27 GBUS-TOP1:H2.28 | 32.31,1.52 32.62,1.88 41.38,1.88 42.07,2.52 42.07,5.01
  L16/BottomSignal 0.559: GBUS-TOP1:G1.18 GBUS-TOP1:G1.17 GBUS-TOP1:G1.16 26.8,0.8 GBUS-TOP1:G1.15 GBUS-TOP1:G1.14 28.91,0.8 GBUS-TOP1:G1.13 29.8,0.8 GBUS-TOP1:G1.12 GBUS-TOP1:G1.11 31.81,0.8 GBUS-TOP1:G1.10
GBUS-TOP1:M-5V-BUS
  L16/BottomSignal 0.254: GBUS-TOP1:G1.1 42.63,0.8 43.3,1.47 43.3,3.84 GBUS-TOP1:H2.26 GBUS-TOP1:H2.25
  pour L16/BottomSignal (no thermals): 41.45,1.41 41.42,0.22 33.17,0.19 33.18,1.38
GBUS-TOP1:M-5V-USB-CHG  (via drill 0.15)
  L14/Power2 0.254: v23.76,1.98 24.62,1.98 25.51,2.87 25.51,5.84 25.94,6.27 32.93,6.27 33.18,6.53 v33.18,11.33
  L16/BottomSignal 0.254: GBUS-TOP1:G1.48 23.76,2.13 v23.76,1.98 | v33.18,11.33 35.75,11.33 GBUS-TOP1:H1.32
GBUS-TOP1:M-12V-BUS
  L16/BottomSignal 0.254: GBUS-TOP1:G2.59 46.64,3
  L16/BottomSignal 0.559: GBUS-TOP1:G2.58 46.64,3 GBUS-TOP1:G2.59 GBUS-TOP1:G2.60
  L16/BottomSignal 0.61: GBUS-TOP1:G2.58 47.16,5 GBUS-TOP1:H2.24 GBUS-TOP1:H2.23
GBUS-TOP1:M-SW2-12V
  L16/BottomSignal 0.254: GBUS-TOP1:H2.10 64.86,3.3 GBUS-TOP1:G2.40
  L16/BottomSignal 0.559: 64.86,3.3 64.46,3.3 GBUS-TOP1:G2.41
GBUS-TOP1:M-SW3-BAT
  L16/BottomSignal 0.254: GBUS-TOP1:G2.43 62.39,3 63.61,4.22 63.61,5.87 63.58,5.87 63.2,6.25 62.72,6.25 62.54,6.43 62.54,7.4 GBUS-TOP1:H2.11
  L16/BottomSignal 0.559: GBUS-TOP1:G2.42 GBUS-TOP1:G2.43
GBUS-TOP1:M-SW4-BAT
  L16/BottomSignal 0.254: GBUS-TOP1:G2.44 61.16,3.92 GBUS-TOP1:H2.12
  L16/BottomSignal 0.559: GBUS-TOP1:G2.44 GBUS-TOP1:G2.45
GBUS-TOP1:M-SW5-5V  (via drill 0.18)
  L1/TopSignal 0.254: v58.63,3.99 58.63,6.47 GBUS-TOP1:H2.13
  L16/BottomSignal 0.254: v58.63,3.99 59.16,3.46 GBUS-TOP1:G2.46
  L16/BottomSignal 0.559: GBUS-TOP1:G2.46 GBUS-TOP1:G2.47
GBUS-TOP1:M-SW6-5V
  L16/BottomSignal 0.254: GBUS-TOP1:G2.48 57.16,3.43 58.5,4.78 58.5,6.36 GBUS-TOP1:H2.15
  L16/BottomSignal 0.559: GBUS-TOP1:G2.49 GBUS-TOP1:G2.48
GBUS-TOP1:M-SW7-5V
  L16/BottomSignal 0.254: GBUS-TOP1:G2.50 55.16,3.72 55.46,4.01 55.58,4.01 55.86,4.29 56.45,4.29 GBUS-TOP1:H2.16
  L16/BottomSignal 0.559: GBUS-TOP1:G2.51 GBUS-TOP1:G2.50
GBUS-TOP1:M-SW8-3V3
  L16/BottomSignal 0.254: GBUS-TOP1:G2.52 53.16,3.93 53.45,4.22 53.84,4.22 GBUS-TOP1:H2.18
  L16/BottomSignal 0.559: GBUS-TOP1:G2.53 GBUS-TOP1:G2.52
GBUS-TOP1:M-SW9-3V3
  L16/BottomSignal 0.254: GBUS-TOP1:G2.54 51.16,4.12 50.93,4.34 50.93,6.39 GBUS-TOP1:H2.19
  L16/BottomSignal 0.559: GBUS-TOP1:G2.55 GBUS-TOP1:G2.54
GBUS-TOP1:M-SW10-3V3  (via drill 0.18)
  L1/TopSignal 0.254: v48.62,3.94 48.83,3.83 49.03,3.83 49.08,3.83 51.12,3.83 51.14,3.86 GBUS-TOP1:H2.20
  L16/BottomSignal 0.254: GBUS-TOP1:G2.56 49.16,3.6 | 48.96,3.6 v48.62,3.94
  L16/BottomSignal 0.406: 49.16,3.6 48.96,3.6
  L16/BottomSignal 0.559: GBUS-TOP1:G2.57 GBUS-TOP1:G2.56
GBUS-TOP1:RBF_SW  (via drill 0.15)
  L1/TopSignal 0.254: GBUS-TOP1:H2.38 29.3,3.66 28.89,3.25 v10.85,3.25
  L16/BottomSignal 0.203: GBUS-TOP1:H2.38 GBUS-TOP1:H2.37
  L16/BottomSignal 0.254: v10.85,3.25 11.51,3.25 GBUS-TOP1:G1.60 11.76,1.35 GBUS-TOP1:G1.30
GBUS-TOP1:SEP_SW1  (via drill 0.18 pad 0.56, 0.2 pad 0.61)
  L14/Power2 0.254: v12.83,1.85 12.33,2.39 12.33,3.63 12.81,4.12 12.81,4.75 12.78,4.78 12.78,8.03 13.04,8.28 13.04,8.56 13.06,8.59 v13.06,8.84
  L16/BottomSignal 0.254: GBUS-TOP1:G1.58 13.76,2.7 13.09,1.98 12.96,1.85 v12.83,1.85 | v13.06,8.84 13.09,8.87 14.99,8.87 15.32,9.2 15.32,11.02 15.73,11.43 17.28,11.43 17.84,10.87 17.84,9.68 18.68,8.84 22.82,8.84 22.94,8.97 22.94,10.97 23.4,11.43 24.72,11.43 25.51,10.64 25.51,8.51 26.4,7.62 GBUS-TOP1:H2.39
GBUS-TOP1:SEP_SW2
  L16/BottomSignal 0.178: GBUS-TOP1:H2.40 25.69,4.01 13.04,4.01 12.76,3.73 GBUS-TOP1:G1.59
GND  (via drill 0.15, 0.15 pad 0.46)
  L2/TopGround 0.254: B8.GND@3 6.69,90.5 8.36,88.82 8.36,86.88 B8.GND 10.02,83.18 11.64,81.56 11.64,68.33 12.02,67.94
  L16/BottomSignal 0.254: GBUS-TOP1:G2.37 68.16,3.83 v68.11,3.96 | v63.69,67.18 62.77,67.06 PM-V2L2-1:C4.2 | v73.9,67.08 72.5,67.08 PM-V2L2-1:SJ3.1 69.65,66.45 PM-V2L2-1:SJ4.1 | v71.33,56.67 71.33,59.19 PM-V2L2-1:C5.K1 | 23.31,1.08 22.66,1.73 v21.83,1.73 | PM-V2L2-1:U1.B4 PM-V2L2-1:U1.A5 47.9,67.23 PM-V2L2-1:R4.1
  L16/BottomSignal 0.406: v13.93,40.46 14.38,40.46 14.61,40.23
  other vias: 49.59,1.78 73.9,50.75 52.38,67.46 19.49,45.42
  pour L16/BottomSignal (no thermals): 24.65,2.43 40.86,2.44 40.9,3.56 24.68,3.56
  pour L16/BottomSignal: 48.67,1.33 59.83,1.35 59.84,0.24 48.65,0.23
  pour L16/BottomSignal (no thermals): 44.86,68.88 44.86,63.91 38.57,64.03 38.49,67.92 40.8,67.89 40.8,69.11 42.1,69.11 42.07,70.54 48.6,70.51 48.62,69.14 49.87,69.09 49.79,67.44 49.49,67.44 49.11,67.06 49.11,65.68 49.61,65.18 52.55,65.18 52.59,67.97 53.48,67.94 53.4,72.69 50.94,72.72 50.96,73.89 34.98,73.79 34.96,77.88 34.96,78.11 35.49,78.18 35.37,84.1 33.71,84.07 33.79,68.15 33.94,63.04 45.8,62.97 45.7,63.86 45.7,68.91
  pour L1/TopSignal: 68.16,34.14 67.52,34.14 67.52,27.28 68.05,27.28 68.05,27.25 68.16,27.25
  pour L16/BottomSignal: 10.24,66.67 22.49,66.67 22.49,14.68 14.46,14.68 14.46,20.52 10.22,20.52
  pour L1/TopSignal: 14.46,14.17 14.46,16.28 65.21,16.28 65.21,63.25 69.48,67.51 74.15,67.51 74.68,68.05 74.68,94.36 75.07,94.74 86.5,94.74 87.56,93.68 87.56,77.8 87.05,77.29 86.22,77.29 85.96,77.55 85.96,82.52 85.76,82.73 78.77,82.73 78.04,81.99 78.04,20.73 77.5,20.19 74,20.19 73.54,19.74 73.54,14.63 74.15,14.02 86.83,14.02 87.51,13.34 87.51,0.56 87.26,0.3 1.63,0.3 0.16,1.78 0.24,13.89 0.57,14.02
  pour L16/BottomSignal: 14.05,14.05 14.74,14.73 14.74,15.54 15.35,16.15 71.71,16.15 74,13.87 86.88,13.87 87.54,13.21 87.54,0.41 87.59,0.36 1.53,0.36 0.29,1.6 0.29,13.92
  pour L2/TopGround: 12.4,94.72 13.27,93.85 13.27,67.94 13.62,67.59 32.11,67.59 32.49,67.97 32.49,92.84 33.46,93.8 54.87,93.8 55.71,92.96 55.71,67.87 55.91,67.67 74.35,67.67 74.71,68.02 74.71,94.13 75.37,94.79 86.22,94.79 87.66,93.34 87.66,77.62 87.69,77.6 86.11,77.6 85.91,77.8 85.91,82.6 85.68,82.83 78.65,82.83 77.83,82.02 77.83,14.48 78.57,13.74 87.03,13.74 87.13,13.64 87.13,13.36 87.61,12.88 87.61,0.91 86.98,0.28 1.74,0.28 0.21,1.8 0.24,13.87 9.74,14.1 10.19,14.55 10.19,14.63 9.76,15.06 9.76,82.25 9.61,82.4 7.07,82.4 6.69,82.02 6.69,77.62 6.84,77.47 0.64,77.47 0.36,77.75 0.36,94.67 0.34,94.69
  pour L15/BottomGround (isolate 0.152): 0.31,94.34 12.71,94.34 13.22,93.83 13.22,68 13.62,67.59 32.14,67.59 32.67,68.12 32.67,92.99 33.36,93.68 55.02,93.68 55.63,93.07 55.63,67.92 55.91,67.64 74.48,67.64 74.76,67.92 74.76,94.46 75.09,94.79 86.8,94.79 87.56,94.03 87.56,77.52 87.54,77.5 86.17,77.5 85.91,77.75 85.91,82.5 85.68,82.73 78.67,82.73 78.04,82.09 78.04,14.4 78.6,13.84 87.26,13.84 87.33,13.92 87.33,0.53 87.08,0.28 1.66,0.28 0.26,1.68 0.26,13.82 0.52,14.07 9.81,14.07 9.86,14.12 9.86,82.07 9.48,82.45 2.42,82.45 2.22,82.25 2.22,77.47 2.35,77.34 0.82,77.34 0.36,77.8 0.36,94.21 0.34,94.23
MCAT_SCL  (via drill 0.18, 0.18 pad 0.56)
  L1/TopSignal 0.254: v66.99,24.41 66.99,16.71 65.9,14.88 26.68,14.88 20.25,14.88 20.18,14.96 19.59,14.96 19.36,14.73 v18.42,15.6 | v66.99,41.33 66.99,41.53 67.17,41.71 67.72,41.71 J2.50
  L16/BottomSignal 0.254: CT-V2L1-1:U1.2 18.47,16.41 CT-V2L1-1:R3.1 v18.42,15.6 | v66.99,24.41 v66.99,41.33
MCAT_SDA  (via drill 0.18 pad 0.56)
  L1/TopSignal 0.254: J2.49 70.18,41.47 69.96,41.25 69.96,28.4 v69.53,27.96 | v25.66,15.52 22.99,15.52 21.83,16.69 21.83,23.04 21.09,23.77 v18.91,23.77
  L16/BottomSignal 0.254: v69.53,27.96 69.53,26.87 68.97,26.31 68.89,18.77 66.51,16.31 66.17,15.95 65.74,15.52 64.55,15.52 64.19,15.88 27.62,15.88 27.26,15.52 v25.66,15.52 | v18.91,23.77 18.8,23.77 | CT-V2L1-1:U1.7 18.6,22.36 18.45,22.51 18.45,23.24 18.91,23.7 v18.91,23.77 | CT-V2L1-1:R1.1 15.36,23.1 16.04,23.77 v18.91,23.77
P3  (via drill 0.18 pad 0.56, 0.2 pad 0.56, 0.2 pad 0.61)
  L1/TopSignal 0.254: v19.92,18.16 19.92,17.78 19.67,17.53 17.25,17.53 16.87,17.14 16.87,16.94 16.67,16.74 v16.14,16.74 | v71.97,33.35 71.18,33.35 | 71.18,33.35 J2.23 | v16.16,21.87 16.16,23.98 v15.68,24.46 | v11.95,47.75 11.95,46.38 11.62,46.05 11.62,40.01 v11.69,39.93 | 71.18,33.35 71.13,33.35 J2.21
  L3/Power1 0.254: v15.02,34.77 15.02,34.42 15.55,33.88 19.62,33.88 21.12,32.38 21.12,16.41 21.98,15.6 | 21.98,15.6 23.07,14.58 25.33,14.58 | 25.33,14.58 25.26,14.58 25.33,14.58 | 25.33,14.58 25.64,14.58 27.03,15.9 63.74,15.85 64.5,15.09 65.62,15.09 67.88,17.27 67.88,18.67 73.44,24.23 73.44,32.74 72.83,33.35 v71.97,33.35 | v19.77,15.6 20.63,15.6 21.98,15.6
  L16/BottomSignal 0.254: v19.92,18.16 19.8,18.04 CT-V2L1-1:U1.1 19.12,17.04 CT-V2L1-1:R3.2 19.8,16.36 v19.77,15.6 | v16.14,16.74 15.91,17.25 CT-V2L1-1:R2.2 15.54,17.95 15.41,17.95 14.97,18.39 14.97,20.95 CT-V2L1-1:R1.2 | CT-V2L1-1:R1.2 13.26,21.35 12.86,21.74 CT-V2L1-1:BC3.1 12.85,27.62 CT-V2L1-1:BC4.1 | v15.02,34.77 v15.01,34.78 15.01,35.91 PM-V2L2-1:C7.1 | CT-V2L1-1:R1.2 15.64,21.35 v16.16,21.87 | v15.68,24.46 15.76,24.54 CT-V2L1-1:JMP1.1 | PM-V2L2-1:U2.4 PM-V2L2-1:U2.3 18.03,41.63 PM-V2L2-1:C8.1 17.83,41.17 17.08,40.41 17.08,38.56 PM-V2L2-1:C7.1 | PM-V2L2-1:C7.1 14,37.51 PM-V2L2-1:TP1.1 11.69,37.56 v11.69,39.93 | PM-V2L2-1:R7.2 11.79,47.59 v11.95,47.75
P5  (via drill 0.18 pad 0.56)
  L1/TopSignal 0.254: v16.11,38.94 v16.11,36.65
  L16/BottomSignal 0.254: CT-V2L1-1:JMP1.3 16.91,31.68 PM-V2L2-1:TP2.1 PM-V2L2-1:R9.2 | PM-V2L2-1:R9.2 18.28,37.12 18.27,37.11 20.32,37.11 PM-V2L2-1:C9.1 | PM-V2L2-1:U2.8 PM-V2L2-1:U2.7 15.43,41.89 PM-V2L2-1:C10.1 15.92,40.42 16.11,40.23 v16.11,38.94 | v16.11,36.65 17.79,36.65 PM-V2L2-1:R9.2
P12_IN  (via drill 0.15 pad 0.81, 0.2 pad 0.56)
  L1/TopSignal 0.406: 72.98,47.59 CT-V2L1-1:J7.2 72.69,47.9 71.31,47.9 71.1,47.7 v69.78,47.7 | GBUS-TOP1:H2.8 68.67,6.34 68.67,13.51 68.67,14.53 68.67,16.38 72.48,20.19 72.48,25.27 76.56,28.88 76.56,40.77 v76.56,41.83
  L14/Power2 0.406: v21.78,41.48 21.78,16.99 24.14,14.63 28.74,14.63 29.32,15.21 64.86,15.21 65.95,16.31 65.95,43.81 67.79,45.66 | 67.79,45.66 69.81,47.68 v69.78,47.7 | v76.56,41.83 70.09,41.83 67.88,44.04 67.88,45.57 67.79,45.66
  L16/BottomSignal 0.254: PM-V2L2-1:U2.18 PM-V2L2-1:U2.17 | PM-V2L2-1:R6.2 15.43,49.12 PM-V2L2-1:U2.14 PM-V2L2-1:U2.13 14.78,47.74 14.56,47.52 13.6,47.52 13.47,47.65 PM-V2L2-1:U2.11 | PM-V2L2-1:R6.2 17.14,50.13 18.02,49.25 18.02,48.55 PM-V2L2-1:U2.18 | PM-V2L2-1:U2.18 18.03,47.84 18.3,47.57 19.13,47.57 19.34,47.78 PM-V2L2-1:U2.20 | PM-V2L2-1:U2.20 19.33,48.34 PM-V2L2-1:BC2.1 | PM-V2L2-1:R6.2 PM-V2L2-1:R5.2 | PM-V2L2-1:U2.20 19.34,50.18 PM-V2L2-1:C6.1
  L16/BottomSignal 0.406: GBUS-TOP1:H2.8 67.4,4.24 GBUS-TOP1:G2.39 | v21.78,41.48 21.39,41.66 20.94,41.66 20.71,41.88 20.63,42.42 20.63,42.62 PM-V2L2-1:BC1.1 20.25,44.2 PM-V2L2-1:BC2.1
  L16/BottomSignal 0.559: GBUS-TOP1:G2.38 GBUS-TOP1:G2.39
PGOOD_PMA  (via drill 0.18 pad 0.51, 0.18 pad 0.56)
  L1/TopSignal 0.203: v47.33,70.21 47.33,66.98 47.89,66.42 67.39,66.45 68.36,65.94 68.31,62.56 69.71,61.49 69.71,60.05 69.68,56.41 69.68,54.79 v69.65,49.35 70.21,48.8 CT-V2L1-1:J7.3
  L16/BottomSignal 0.203: PM-V2L2-1:U1.B5 v47.33,70.21
PM-V2L2-1:ADJ1  (2 unrouted)
PM-V2L2-1:ADJ2  (2 unrouted)
PM-V2L2-1:BYP1
  L16/BottomSignal 0.254: PM-V2L2-1:U2.2 18.68,41.88 PM-V2L2-1:C8.2
PM-V2L2-1:BYP2
  L16/BottomSignal 0.254: PM-V2L2-1:U2.9 14.13,41.89 PM-V2L2-1:C10.2
PM-V2L2-1:INTVCC  (via drill 0.18 pad 0.41, 0.18 pad 0.46)
  L3/Power1 0.254: v47.27,74.08 47.25,72.96 46.26,72.19 46.24,72.16 46.24,71.42 45.47,70.66 44.03,70.66 43.47,70.1 43.47,69.16 43.42,69.11 v43.44,68.99
  L16/BottomSignal 0.254: PM-V2L2-1:U1.F5 47.86,74.72 v47.27,74.08 | v43.44,68.99 v43.43,68.99 PM-V2L2-1:U1.A9 42.82,67.03 PM-V2L2-1:R1.1
PM-V2L2-1:P18_OUT  (via drill 0.46 pad 0.56)
  L3/Power1 0.508: v55.74,63.42 56.55,64.24 66.35,64.24 66.99,63.6 v67.01,63.6
  L16/BottomSignal 0.508: PM-V2L2-1:L3.2 58.15,63.42 v55.74,63.42 | v67.01,63.6 66.67,63.25 PM-V2L2-1:SJ6.1 66.02,60.76 66.02,57.1 68.77,54.36 70.19,54.36 71.43,53.11 PM-V2L2-1:C5.A1
PM-V2L2-1:PWRDGD2
  L16/BottomSignal 0.254: PM-V2L2-1:R6.1 14.78,50.13 14.18,49.53 14.18,48.59 PM-V2L2-1:U2.12
PM-V2L2-1:PWRGD1
  L16/BottomSignal 0.254: PM-V2L2-1:R5.1 17.75,50.92 18.68,49.99 PM-V2L2-1:U2.19
PM-V2L2-1:RSENSE  (via drill 0.18 pad 0.46, 0.18 pad 0.51, 0.18 pad 0.56)
  L1/TopSignal 0.254: v47.28,76.58 47.35,76.58 48.24,75.69 48.24,68.07 v48.75,67.56
  L16/BottomSignal 0.254: v48.75,67.56 48.75,67.95 PM-V2L2-1:U1.A4
  other vias: 39.63,76.66 39.66,75.34 40.9,75.39 40.9,76.66 42.17,76.66 43.47,76.63 44.76,76.63 46.01,76.63 45.98,77.9 47.2,77.93 47.28,79.22 47.25,80.49 47.25,81.79 46.21,79.17 46.27,80.44 43.44,75.36 44.69,75.34 42.17,75.36 36.15,76.54 37.12,76.54
  pour L16/BottomSignal (isolate 0.305, no thermals): 45.91,74.45 45.88,75.46 48.12,75.46 48.17,82.88 46.16,82.85 46.19,79.1 45.12,79.07 45.07,77.67 35.82,77.72 35.85,74.32
  pour L1/TopSignal (isolate 0.305): 35.82,77.72 45.07,77.7 45.04,79.07 46.19,79.1 46.16,82.85 48.14,82.93 48.09,75.46 45.88,75.46 45.93,74.45 35.87,74.32
PM-V2L2-1:SETFREQ  (via drill 0.18 pad 0.51)
  L1/TopSignal 0.254: v44.69,67.61 v44.69,69.04
  L16/BottomSignal 0.254: PM-V2L2-1:R2.1 43.98,66.23 PM-V2L2-1:R1.2 43.98,66.91 v44.69,67.61 | PM-V2L2-1:U1.B8 v44.69,69.04
PM-V2L2-1:SGND  (via drill 0.18 pad 0.51, 0.18 pad 0.56)
  L15/BottomGround 0.203: v45.93,68.94 46.67,68.59 46.67,66.31 46.68,65.86 46.83,65.65 47.36,65.62 v47.56,65.23
  L16/BottomSignal 0.203: PM-V2L2-1:U1.A7 v45.92,68.94 v45.93,68.94 | v47.56,65.23 47.5,65.28 PM-V2L2-1:R2.2 | v73.36,64.34 72.09,64.34 PM-V2L2-1:SJ3.2 71.85,64.58 PM-V2L2-1:SJ4.2
  pour L15/BottomGround (isolate 0.635, no thermals): 45.35,64.33 45.13,71.13 48.88,71.17 48.75,66.22 73.76,66.59 74.79,64.74 74.79,63.22 74.76,63.2 68.56,63.2 66.84,64.44
PM-V2L2-1:SW1  (via drill 0.2 pad 0.51)
  other vias: 49.86,81.69 51.07,81.69 52.34,81.69 49.8,82.96 51.13,82.96 52.34,83.02 52.34,80.48 51.07,80.48 49.8,80.42 54.37,86.07 53.67,86.07 52.97,86.77 52.91,87.4 52.91,88.04 52.91,88.67 52.85,89.31 52.85,89.94 53.67,90.58 54.31,90.64 53.04,90.58 52.97,86.13 49.8,79.15 51.07,79.15 52.4,79.15 51.13,84.1 53.63,81.67 53.61,80.48 53.66,79.16
  pour L16/BottomSignal (no thermals): 48.93,78.3 48.97,93.14 54.1,93.19 55.52,91.8 55.49,78.27
  pour L1/TopSignal: 48.93,78.3 55.49,78.27 55.53,91.77 54.08,93.22 48.98,93.14
PM-V2L2-1:SW2  (via drill 0.2 pad 0.51)
  other vias: 45.04,86.13 45.75,86.11 46.21,86.69 46.19,87.38 46.16,88.06 46.13,88.8 46.13,89.48 46.11,90.17 45.47,90.47 44.84,90.47 43.42,81.71 44.74,81.74 44.69,80.44 43.42,80.44 43.42,79.17 43.42,83.03 44.76,83.03
  pour L16/BottomSignal (no thermals): 44.48,78.33 44.46,79.71 45.5,79.65 45.45,83.49 48.17,83.52 48.27,93.17 44,93.07 44.04,84.85 42.55,82.83 42.58,78.33
  pour L1/TopSignal (isolate 0.305, no thermals): 42.58,78.36 44.48,78.36 44.46,79.71 45.5,79.65 45.45,83.49 48.17,83.49 48.27,93.17 44,93.07 44.04,84.85 43.87,84.63 42.55,82.8
PM-V2L2-1:VFB
  L16/BottomSignal 0.203: 46.65,69.64 47.25,69.04 47.25,67.79 47.23,67.79 46.69,67.77 PM-V2L2-1:R4.2
  L16/BottomSignal 0.254: PM-V2L2-1:U1.B6 46.65,69.64
PM-V2L2-1:VIN  (via drill 0.15, 0.2 pad 0.51)
  other vias: 40.93,81.71 37.57,79.68 36.76,80.04 40.95,80.44 38.46,81.71 39.66,82.91 40.93,82.93 39.68,81.71 39.66,80.42 39.61,79.12 40.95,79.15 38.46,80.39 38.41,79.1
  pour L16/BottomSignal (isolate 0.305, no thermals): 41.75,78.31 41.72,83.08 43.26,85.14 43.37,91.74 42.53,93.17 37.35,93.17 36.84,92.66 36.76,85.42 36.13,84.15 36.25,78.3
PM-V2L2-1:VOUT  (via drill 0.2 pad 0.51)
  L16/BottomSignal 0.254: 54.54,72.26 v54.49,72.31
  other vias: 49.77,76.66 51.06,76.63 52.33,76.63 52.33,75.31 51.01,75.31 49.79,75.31 52.28,74.09 53.75,76.66 53.73,75.39 53.63,74.02
  pour L16/BottomSignal (no thermals): 48.83,77.72 55.53,77.62 55.48,75.79 55.48,67.41 73.39,67.41 73.36,62.28 48.17,62.18 48.19,64.57 53.2,64.52 53.15,67.34 54.09,67.39 54.01,73.3 51.52,73.3 51.52,74.47 48.85,74.45
SCLIN  (via drill 0.15, 0.15 pad 0.51)
  L3/Power1 0.254: v50.4,1.91 50.4,2.92 50.96,3.48 50.96,5.84 50.45,6.35 48.88,6.35 48.32,6.91 48.32,14.25 47.81,14.76 27.36,14.76 26.75,14.15 26.5,14.15 26.37,14.02 23.33,14.02 v22.84,13.54
  L14/Power2 0.254: v62.57,1.78 62.57,1.14 62.42,0.99 51.55,0.99 v50.4,1.91
  L16/BottomSignal 0.254: CT-V2L1-1:U1.3 17.82,17.18 17.61,16.97 17.61,15.01 18.02,14.58 20.1,14.58 GBUS-TOP1:H1.43 22.52,13.54 v22.84,13.54 | GBUS-TOP1:G2.13 62.71,1.38 v62.57,1.78
SDAIN  (via drill 0.15, 0.15 pad 0.51)
  L14/Power2 0.254: v63.53,1.78 63.53,0.99 63,0.46 2.5,0.46 0.92,2.03 0.92,6.66 2.9,8.64 4.55,8.64 5.6,9.68 8.69,9.68 10.42,11.4 22.44,11.4 v23.05,12.01
  L16/BottomSignal 0.254: CT-V2L1-1:U1.6 17.89,22.16 17.89,21.57 17.89,21.54 17.81,21.46 17.81,20.88 18.22,20.7 20.35,20.7 20.61,20.47 20.94,20.14 21.85,19.3 21.8,14.81 22.72,14.81 23.55,13.97 24.22,13.3 GBUS-TOP1:H1.41 23.53,12.01 v23.05,12.01 | GBUS-TOP1:G2.12 63.71,1.42 v63.53,1.78
SW_RUNPMA  (via drill 0.18 pad 0.51, 0.2 pad 0.51)
  L1/TopSignal 0.254: v72.09,35.28 72.09,34.75 71.61,34.27 J2.25
  L15/BottomGround 0.254: v72.09,35.28 72.12,35.31 72.12,44.5 70.85,45.77 69.5,45.77 66.96,48.31 66.96,53.52 68.56,55.12 68.56,60.27 68.56,60.48 66.35,62.28 46.03,62.28 43.39,65.25 v43.42,67.41
  L16/BottomSignal 0.254: v43.42,67.41 43.46,67.74 PM-V2L2-1:U1.A8
UART0_RX  (via drill 0.18 pad 0.51)
  L1/TopSignal 0.203: J2.48 68.26,41.17 68.45,41.36 68.45,43.4 68.87,44.06 71.38,44.06 v71.51,44.06 | v74.33,51.74 74.33,52.05 73.99,52.39 73,52.39 CT-V2L1-1:J7.6
  L14/Power2 0.203: v71.51,44.06 72.63,44.06 74.53,45.76 74.53,51.54 v74.33,51.74
UART0_TX
  L1/TopSignal 0.254: CT-V2L1-1:J7.7 73.74,53.6 74.79,53.59 75.09,53.29 75.12,41.83 74.13,40.87 J2.47
VBATT_IN  (via drill 0.18 pad 0.51, 0.2 pad 0.56, 0.46 pad 0.76, 0.46 pad 0.81)
  L1/TopSignal 0.254: GBUS-TOP1:H2.45 19.14,7.35 18.12,6.33 10.73,6.33 9.74,7.32 9.74,10.54 9.74,10.64 v8.39,11.99
  L1/TopSignal 0.406: v70.65,46.4 v70.65,46.41
  L1/TopSignal 0.508: CT-V2L1-1:J7.1 v70.65,46.4
  L3/Power1 0.254: v19.64,2.01 20.25,2.01 20.43,2.36 20.43,4.45 v20.28,4.6
  L3/Power1 0.508: v70.65,46.41 69.5,46.41 67.66,48.25 67.65,57.44 68.49,58.28 68.49,59.59 67.66,60.41 67.66,62.06 68.81,63.21 68.81,64.17 67.52,65.46 52.31,65.46 49.59,62.74 36.74,62.74 v33.23,66.24
  L14/Power2 0.508: v8.39,11.99 10.55,14.15 11.87,14.15 11.95,14.22 14.59,14.22 15.27,14.22 15.98,14.22 16.59,14.99 17.03,15.67 16.95,50.09 16.92,53.01 15.22,53.01 v14.03,54.2 | v17.86,59.54 18.98,59.54 24.6,65.15 32.14,65.15 v33.23,66.24
  L16/BottomSignal 0.254: v8.39,11.99 9.74,10.64 9.74,7.32 10.73,6.33 18.12,6.33 19.14,5.3 GBUS-TOP1:H2.46 19.88,4.75 v20.28,4.6 | GBUS-TOP1:G1.53 18.78,3 18.78,3.02 19.26,3.2 | 19.26,3.2 19.14,3.31 19.14,2.61 v19.64,2.01 | 19.26,3.2 GBUS-TOP1:G1.52
  L16/BottomSignal 0.508: PM-V2L2-1:L1.1 33.16,78.59 33.17,78.58 PM-V2L2-1:BC3.1 33.39,78.49 33.41,76.05 34.23,75.23 PM-V2L2-1:BC4.1 34.3,70.28 34.3,67.61 33.23,66.55 v33.23,66.24 | v14.03,54.2 14.17,54.2 PM-V2L2-1:C1.A1 16.28,57.95 v17.86,59.54
  L16/BottomSignal 0.61: GBUS-TOP1:G1.57 GBUS-TOP1:G1.56 GBUS-TOP1:G1.55 GBUS-TOP1:G1.54 GBUS-TOP1:G1.53 | GBUS-TOP1:G1.52 GBUS-TOP1:G1.51 GBUS-TOP1:G1.50 GBUS-TOP1:G1.49
VOUTA  (via drill 0.2 pad 0.56)
  L1/TopSignal 0.356: 71.67,27.69 71.72,27.65 71.72,27.11 71.67,27.07 70.87,27.07 J2.1 70.7,27.07 68.7,27.07 68.43,26.8 67.18,26.8 66.02,28.12 66.02,57.57 v67.05,59.03 | 71.67,27.69 70.87,27.69 J2.3 | 71.67,28.27 70.87,28.27 J2.5 | 71.67,28.27 71.72,28.23 71.72,27.83 71.67,27.69 | 71.67,28.89 70.87,28.89 J2.7 | 71.67,28.89 71.72,28.85 71.72,28.4 71.67,28.27 | 71.67,29.47 70.87,29.47 J2.9 | 71.67,29.47 71.72,29.43 71.72,29.03 71.67,28.89 | 71.67,30.09 70.87,30.09 J2.11 | 71.67,30.09 71.72,30.05 71.72,29.6 71.67,29.47 | 71.67,30.67 70.87,30.67 J2.13 | 71.67,30.67 71.72,30.63 71.72,30.23 71.67,30.09 | 71.67,31.29 70.87,31.29 J2.15 | 71.67,31.29 71.72,31.25 71.72,30.8 71.67,30.67 | 71.67,31.87 70.87,31.87 J2.17 | 71.67,31.87 71.72,31.83 71.72,31.43 71.67,31.29 | J2.19 70.87,32.49 71.67,32.49 71.72,32.45 71.72,32 71.67,31.87
  L16/BottomSignal 0.356: PM-V2L2-1:TP4.1 71.5,62.5 70.61,62.5 70.56,62.45 70.56,62.27 70.12,61.83 69.27,61.83 69.23,61.87 68.56,61.87 68.56,61.43 PM-V2L2-1:SJ6.2 68.56,61.25 68.56,60.5 68.3,60.23 67.82,59.8 67.01,59.07 v67.05,59.03

## Text on the board
tPlace: HAQUE/TEEL | GWU MCAT / SUBSYSTEM / CANYVAL-X | J7 | J2
bPlace: L1 | L2 | C2 | R3 | R4 | L3 | R1 | SJ4 | SJ3 | C4 | R2 | C3 | SJ6 | TP4 | C1 | C6 | R5 | R6 | U2 | C5 | R7 | R10 | C8 | R8 | C10 | TP1 | C7 | C9 | R9 | TP2 | JMP1 | 5V | 3V3 | R1 | U1 | R2 | R3